# Altium schematic sheet ISO_Signals.SchDoc
size A4; SheetNumber: 6; SheetTotal: 9
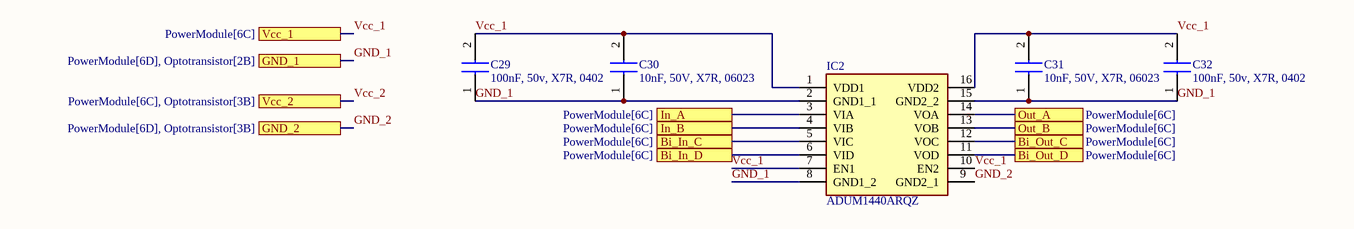
[diagram p0: ISO_Signals.SchDoc]

## Parts
C29  100nF, 50v, X7R, 0402  [CAPC2012X88N]
C30  10nF, 50V, X7R, 06023  [CAPC1608X87N]
C31  10nF, 50V, X7R, 06023  [CAPC1608X87N]
C32  100nF, 50v, X7R, 0402  [CAPC2012X88N]
IC2  ADUM1440ARQZ  [SOP64P600X175-16N]

## Ports
Bi_In_C (see PowerModule[6C]), Bi_In_D (see PowerModule[6C]), Bi_Out_C (see PowerModule[6C]), Bi_Out_D (see PowerModule[6C]), GND_1 (see PowerModule[6D], Optotransistor[2B]), GND_2 (see PowerModule[6D], Optotransistor[3B]), In_A (see PowerModule[6C]), In_B (see PowerModule[6C]), Out_A (see PowerModule[6C]), Out_B (see PowerModule[6C]), Vcc_1 (see PowerModule[6C]), Vcc_2 (see PowerModule[6C], Optotransistor[3B])

## Nets
Bi_In_C: IC2.5(VIC) ; port Bi_In_C
Bi_In_D: IC2.6(VID) ; port Bi_In_D
Bi_Out_C: IC2.12(VOC) ; port Bi_Out_C
Bi_Out_D: IC2.11(VOD) ; port Bi_Out_D
GND_1: C29.1 C30.1 C31.1 C32.1 IC2.2(GND1_1) IC2.8(GND1_2) IC2.15(GND2_2) ; port GND_1
GND_2: IC2.9(GND2_1) ; port GND_2
In_A: IC2.3(VIA) ; port In_A
In_B: IC2.4(VIB) ; port In_B
Out_A: IC2.14(VOA) ; port Out_A
Out_B: IC2.13(VOB) ; port Out_B
Vcc_1: C29.2 C30.2 C31.2 C32.2 IC2.1(VDD1) IC2.7(EN1) IC2.10(EN2) IC2.16(VDD2) ; port Vcc_1
Vcc_2: port Vcc_2

## Library data of the parts
C29 C32 = C0805C104M5RAC: Capacitor; Manufacturer_Name: KEMET; Datasheet Link: https://connect.kemet.com:7667/gateway/IntelliData-ComponentDocumentation/1.0/download/specsheet/C0805C104M5RAC%7bBULK%7d; Height: 0.88mm; Manufacturer_Part_Number: C0805C104M5RAC; Mouser Part Number: 80-C0805C104M5RAC; Mouser Price/Stock: https://www.mouser.co.uk/ProductDetail/KEMET/C0805C104M5RAC?qs=VOOUd%252Bza08rWzt4y8eXMuQ%3D%3D; Arrow Part Number: C0805C104M5RAC; Arrow Price/Stock: https://www.arrow.com/en/products/c0805c104m5rac/kemet-corporation?utm_currency=USD&region=nac
C30 C31 = C0603C103J5RAC: Capacitor; Manufacturer_Name: KEMET; Datasheet Link: https://www.kemet.com/specsheet/C0603C103J5RAC%7BBULK%7D; Height: 0.87mm; Manufacturer_Part_Number: C0603C103J5RAC; Mouser Part Number: 80-C0603C103J5RAC; Mouser Price/Stock: https://www.mouser.co.uk/ProductDetail/KEMET/C0603C103J5RAC?qs=Zjfhvh7dXTOjKlZBdCXdvg%3D%3D; Arrow Part Number: C0603C103J5RAC; Arrow Price/Stock: https://www.arrow.com/en/products/c0603c103j5rac/kemet-corporation?region=nac
IC2 = ADUM1440ARQZ: Integrated Circuit; Manufacturer_Name: Analog Devices; Datasheet Link: https://componentsearchengine.com/Datasheets/2/ADUM1440ARQZ.pdf; Height: 1.75mm; Manufacturer_Part_Number: ADUM1440ARQZ; Mouser Part Number: 584-ADUM1440ARQZ; Mouser Price/Stock: https://www.mouser.co.uk/ProductDetail/Analog-Devices/ADUM1440ARQZ?qs=613q%2FuFLIwR2r1IGUGbFKA%3D%3D; Arrow Part Number: ADUM1440ARQZ; Arrow Price/Stock: https://www.arrow.com/en/products/adum1440arqz/analog-devices?region=europe